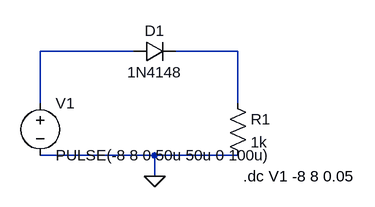
[diagram p0: schematic 1.1.2.asc]
1.1.2.asc, the LTspice schematic file:
Version 4
SHEET 1 880 680
WIRE 224 -16 80 -16
WIRE 384 -16 288 -16
WIRE 80 64 80 -16
WIRE 384 64 384 -16
WIRE 256 144 80 144
WIRE 384 144 256 144
WIRE 256 176 256 144
FLAG 256 176 0
SYMBOL res 368 48 R0
SYMATTR InstName R1
SYMATTR Value 1k
SYMBOL diode 224 0 R270
WINDOW 0 32 32 VTop 2
WINDOW 3 0 32 VBottom 2
SYMATTR InstName D1
SYMATTR Value 1N4148
SYMBOL voltage 80 48 R0
WINDOW 123 0 0 Left 0
WINDOW 39 0 0 Left 0
SYMATTR InstName V1
SYMATTR Value PULSE(-8 8 0 50u 50u 0 100u)
TEXT 392 176 Left 2 !.dc V1 -8 8 0.05

The netlist it stands for:
* 1.1.2.asc
R1 N002 0 1k
D1 N001 N002 1N4148
V1 N001 0 PULSE(-8 8 0 50u 50u 0 100u)
.model D D
.lib standard.dio
.dc V1 -8 8 0.05
.backanno
.end

* Results of the author's LTspice run, read from the files saved beside the schematic
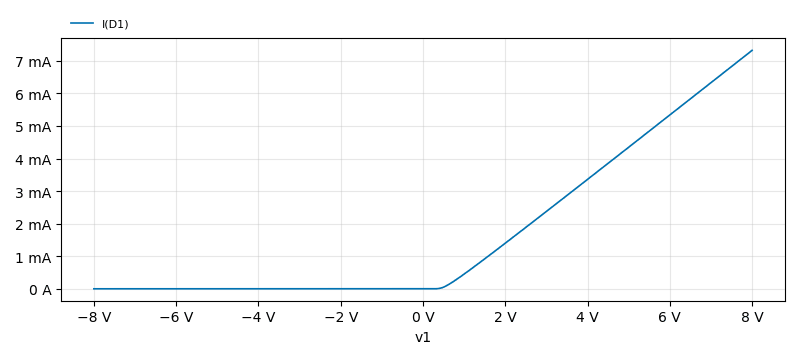
[diagram p1: DC transfer characteristic of 1.1.2.asc, plotted from the saved traces]
* DC transfer characteristic, 1 run:
*   I(D1): -2.528 nA at v1=-8 V, 7.321 mA at v1=8 V, min -2.528 nA, max 7.321 mA